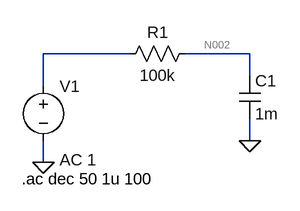
[diagram p0: schematic realim-osc2.asc]
realim-osc2.asc, the LTspice schematic file:
Version 4
SHEET 1 880 680
WIRE 96 112 -32 112
WIRE 272 112 176 112
WIRE 272 144 272 112
WIRE -32 160 -32 112
WIRE 272 240 272 208
WIRE -32 272 -32 240
FLAG 272 240 0
FLAG -32 272 0
SYMBOL res 192 96 R90
WINDOW 0 0 56 VBottom 2
WINDOW 3 32 56 VTop 2
SYMATTR InstName R1
SYMATTR Value 100k
SYMBOL cap 256 144 R0
SYMATTR InstName C1
SYMATTR Value 1m
SYMBOL voltage -32 144 R0
WINDOW 123 24 124 Left 2
WINDOW 39 0 0 Left 0
SYMATTR Value2 AC 1
SYMATTR InstName V1
SYMATTR Value ""
TEXT -64 296 Left 2 !.ac dec 50 1u 100

The netlist it stands for:
* realim-osc2.asc
R1 N002 N001 100k
C1 N002 0 1m
V1 N001 0 AC 1
.ac dec 50 1u 100
.backanno
.end

* Results of the author's LTspice run, read from the files saved beside the schematic
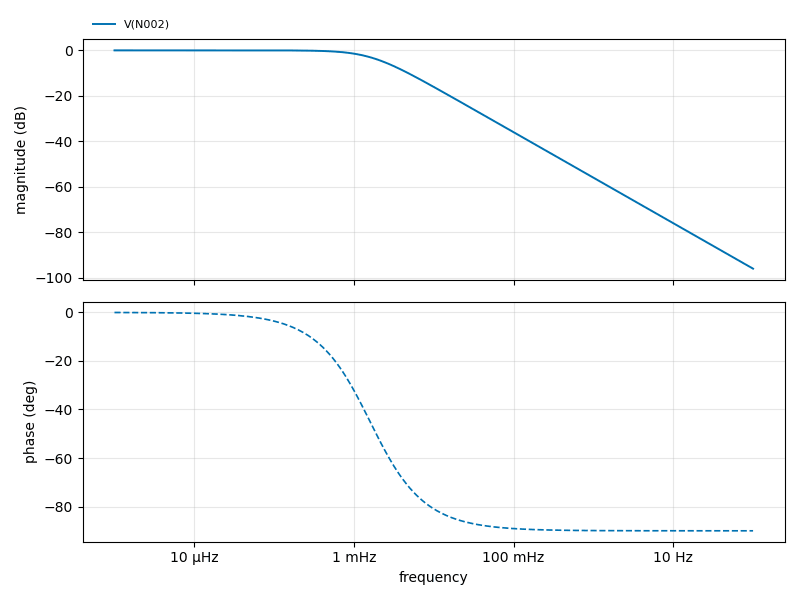
[diagram p1: AC Analysis of realim-osc2.asc, plotted from the saved traces]
* AC Analysis, 1 run:
*   V(N002): -0.00 dB at 1 µHz, -95.96 dB at 100 Hz, peak -0.00 dB at 1 µHz, 3 dB below the peak at 1.591 mHz